# EAGLE design 611_jetbot_128 (EAGLE 9.6.2)
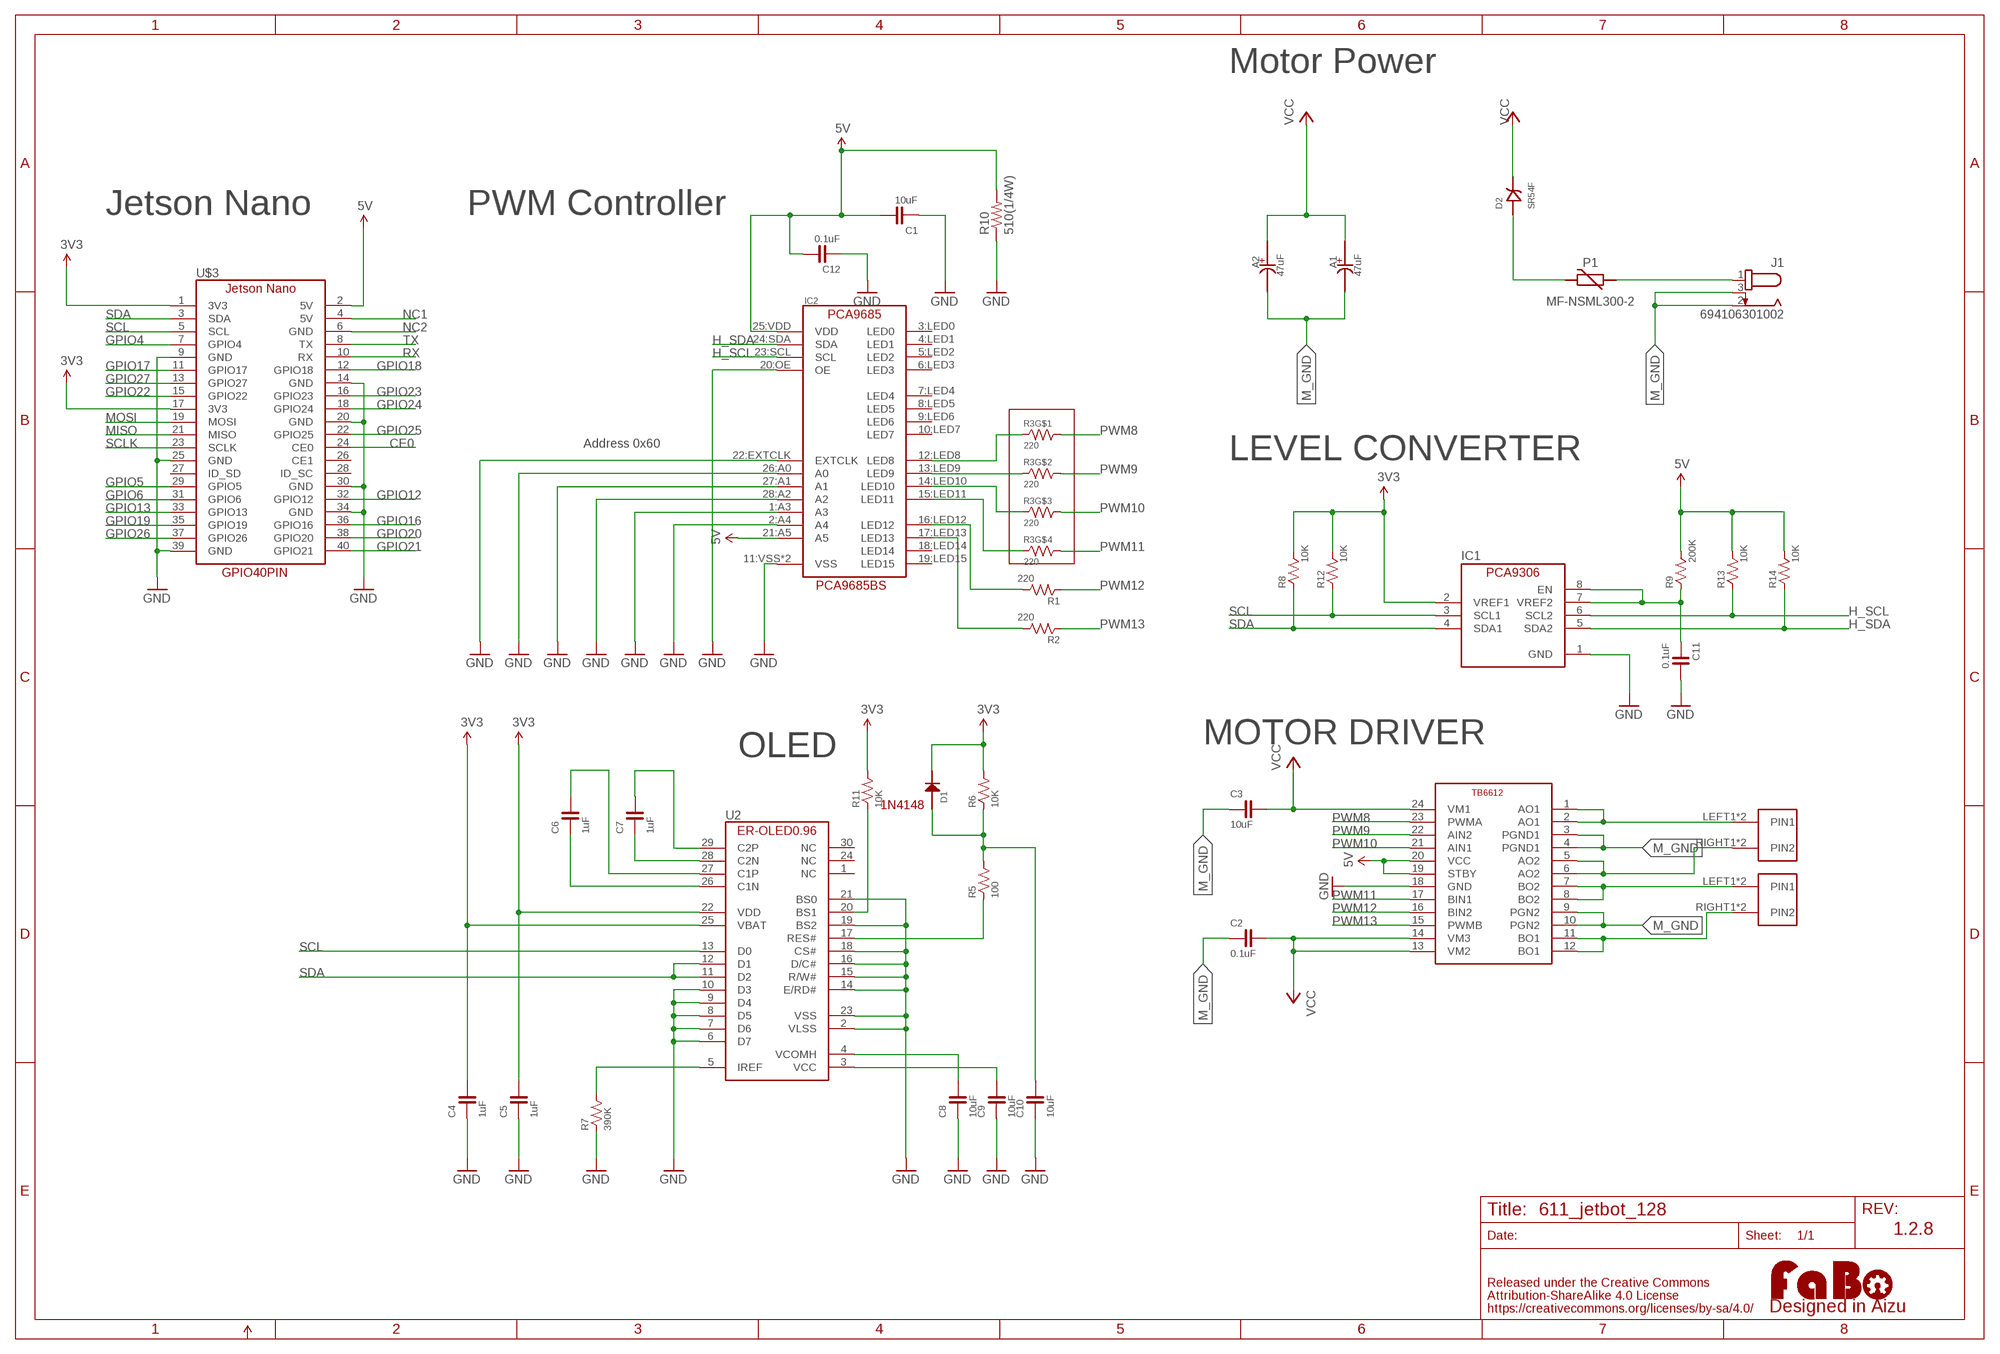
[diagram p0: schematic, sheet 1]

## Parts
A1  47uF  CAPACITOR-ALUMIN_D60  [D60]
A2  47uF  CAPACITOR-ALUMIN_D60  [D60]
C1  10uF  CAPACITOR-0603  [0603]
C2  0.1uF  CAPACITOR-0603  [0603]
C3  10uF  CAPACITOR-0603  [0603]
C4  1uF  CAPACITOR-0603-BOTTOM  [0603-BOTTOM]
C5  1uF  CAPACITOR-0603-BOTTOM  [0603-BOTTOM]
C6  1uF  CAPACITOR-0603-BOTTOM  [0603-BOTTOM]
C7  1uF  CAPACITOR-0603-BOTTOM  [0603-BOTTOM]
C8  10uF  CAPACITOR-0603-BOTTOM  [0603-BOTTOM]
C9  10uF  CAPACITOR-0603-BOTTOM  [0603-BOTTOM]
C10  10uF  CAPACITOR-0603-BOTTOM  [0603-BOTTOM]
C11  0.1uF  CAPACITOR-0603  [0603]
C12  0.1uF  CAPACITOR-0603  [0603]
D1  1N4148  [1N4148W]
D2  SR54F  [SMBF]
IC1  PCA9306_SSOP  [8PIN-SSOP]
IC2  PCA9685BSPCA9685BS  [HVQFN28]
J1  694106301002  [694106301002]
LOGO1  LOGO_FABO-M  [LOGO_FABO_M]
P1  MF-NSML300-2  POLYSWITCH1206  [1206]
R1  220  RESISTOR-0603  [0603]
R2  220  RESISTOR-0603  [0603]
R3  220  RESISTOR_ARRAY  [EXBV8V]
R5  100  RESISTOR-0603-BOTTOM  [0603-BOTTOM]
R6  10K  RESISTOR-0603-BOTTOM  [0603-BOTTOM]
R7  390K  RESISTOR-0603-BOTTOM  [0603-BOTTOM]
R8  10K  RESISTOR-0603  [0603]
R9  200K  RESISTOR-0603  [0603]
R10  510(1/4W)  R-US_R0805  [R0805]
R11  10K  RESISTOR-0603-BOTTOM  [0603-BOTTOM]
R12  10K  RESISTOR-0603  [0603]
R13  10K  RESISTOR-0603  [0603]
R14  10K  RESISTOR-0603  [0603]
U2  ER-OLED0.96-1ER-CON30HT-1_REV2  [ER-CON30HT-1_REV2]
U$3  JETSON_NANO  [JETSON_NANO]
U$5  TB6612  [TB6612]
U$6  ML-1400-S1  [ML-1400-S1]
U$8  ML-1400-S1  [ML-1400-S1]

## Nets
3V3: C4.2 C5.2 D1.CATHODE IC1.2(VREF1) R6.2 R8.2 R11.2 R12.2 U2.22(VDD) U2.25(VBAT) U$3.1(3V3) U$3.17(3V3)
5V: C1.2 C12.2 IC2.21:A5(A5) IC2.25:VDD(VDD) R9.2 R10.2 R13.2 R14.2 U$3.2(5V) U$5.19(STBY) U$5.20(VCC)
CE0: U$3.24(CE0)
GND: C1.1 C4.1 C5.1 C8.1 C9.1 C10.1 C11.2 C12.1 IC1.1(GND) IC2.1:A3(A3) IC2.2:A4(A4) IC2.11:VSS(VSS) IC2.20:OE(OE) IC2.22:EXTCLK(EXTCLK) IC2.26:A0(A0) IC2.27:A1(A1) IC2.28:A2(A2) IC2.29(VSS) R7.1 R10.1 U2.2(VLSS) U2.6(D7) U2.7(D6) U2.8(D5) U2.9(D4) U2.10(D3) U2.14(E/RD#) U2.15(R/W#) U2.16(D/C#) U2.18(CS#) U2.19(BS2) U2.21(BS0) U2.23(VSS) U$3.9(GND) U$3.14(GND) U$3.20(GND) U$3.25(GND) U$3.30(GND) U$3.34(GND) U$3.39(GND) U$5.18(GND)
GPIO4: U$3.7(GPIO4)
GPIO5: U$3.29(GPIO5)
GPIO6: U$3.31(GPIO6)
GPIO12: U$3.32(GPIO12)
GPIO13: U$3.33(GPIO13)
GPIO16: U$3.36(GPIO16)
GPIO17: U$3.11(GPIO17)
GPIO18: U$3.12(GPIO18)
GPIO19: U$3.35(GPIO19)
GPIO20: U$3.38(GPIO20)
GPIO21: U$3.40(GPIO21)
GPIO22: U$3.15(GPIO22)
GPIO23: U$3.16(GPIO23)
GPIO24: U$3.18(GPIO24)
GPIO25: U$3.22(GPIO25)
GPIO26: U$3.37(GPIO26)
GPIO27: U$3.13(GPIO27)
H_SCL: IC1.6(SCL2) IC2.23:SCL(SCL) R13.1
H_SDA: IC1.5(SDA2) IC2.24:SDA(SDA) R14.1
M_GND: A1.MINUS(-) A2.MINUS(-) C2.1 C3.1 J1.2 J1.3 U$5.3(PGND1) U$5.4(PGND1) U$5.9(PGN2) U$5.10(PGN2)
MISO: U$3.21(MISO)
MOSI: U$3.19(MOSI)
N$14: C6.2 U2.27(C1P)
N$16: C6.1 U2.26(C1N)
N$17: U$5.1(AO1) U$5.2(AO1) U$6.LEFT1(PIN1) U$6.LEFT2(PIN1)
N$18: U$5.5(AO2) U$5.6(AO2) U$6.RIGHT1(PIN2) U$6.RIGHT2(PIN2)
N$19: C7.1 U2.28(C2N)
N$20: U$5.7(BO2) U$5.8(BO2) U$8.LEFT1(PIN1) U$8.LEFT2(PIN1)
N$21: C7.2 U2.29(C2P)
N$22: U$5.11(BO1) U$5.12(BO1) U$8.RIGHT1(PIN2) U$8.RIGHT2(PIN2)
N$23: R7.2 U2.5(IREF)
N$24: C8.2 U2.4(VCOMH)
N$25: C9.2 U2.3(VCC)
N$26: R5.1 U2.17(RES#)
N$27: C10.2 D1.ANODE R5.2 R6.1
N$28: R11.1 U2.20(BS1)
N$29: C11.1 IC1.7(VREF2) IC1.8(EN) R9.1
NC1: U$3.4(5V)
NC2: U$3.6(GND)
P8: IC2.12:LED8(LED8) R3.1
P9: IC2.13:LED9(LED9) R3.2
P10: IC2.14:LED10(LED10) R3.3
P11: IC2.15:LED11(LED11) R3.4
P12: IC2.16:LED12(LED12) R1.2
P13: IC2.17:LED13(LED13) R2.2
PTCP1: J1.1 P1.1
PTCP2: D2.ANODE P1.2
PWM8: R3.8 U$5.23(PWMA)
PWM9: R3.7 U$5.22(AIN2)
PWM10: R3.6 U$5.21(AIN1)
PWM11: R3.5 U$5.17(BIN1)
PWM12: R1.1 U$5.16(BIN2)
PWM13: R2.1 U$5.15(PWMB)
RX: U$3.10(RX)
SCL: IC1.3(SCL1) R12.1 U2.13(D0) U$3.5(SCL)
SCLK: U$3.23(SCLK)
SDA: IC1.4(SDA1) R8.1 U2.11(D2) U2.12(D1) U$3.3(SDA)
TX: U$3.8(TX)
VCC: A1.PLUS(+) A2.PLUS(+) C2.2 C3.2 D2.CATHODE U$5.13(VM2) U$5.14(VM3) U$5.24(VM1)
Unconnected: IC2.3:LED0(LED0) IC2.4:LED1(LED1) IC2.5:LED2(LED2) IC2.6:LED3(LED3) IC2.7:LED4(LED4) IC2.8:LED5(LED5) IC2.9:LED6(LED6) IC2.10:LED7(LED7) IC2.18:LED14(LED14) IC2.19:LED15(LED15) U2.1(NC) U2.24(NC) U2.30(NC) U$3.26(CE1) U$3.27(ID_SD) U$3.28(ID_SC)

## Notes on the sheet
- Motor Power
- Jetson Nano | PWM Controller
- Address 0x60
- LEVEL CONVERTER
- GPIO40PIN
- PCA9685BS
- MOTOR DRIVER
- OLED
- 1N4148
- 1.2.8

## Library data of the parts
A1 A2 = FaBo-Capacitor:CAPACITOR-ALUMIN
C1-C12 = FaBo-Capacitor:CAPACITOR: CAPACITOR
D1 = FaBo-Diode:1N4148
D2 = FaBo-Diode:SR54F: SURFACE MOUNT SCHOTTKY BARRIER RECTIFIER 40V Volts 5 Amperes SMBF molded plastic Forwaord Voltage 0.55V DC Reverse Current 0.1mA
IC1 = FaBo-LevelTranslator:PCA9306
IC2 = FaBo-Motor:PCA9685BS
J1 = DC Power Jacks:694106301002: CONN PWR JACK 2.1X5.5MM SOLDER Manufacturer's datasheet <https://katalog.we-online.de/em/datasheet/6941xx301002.pdf>; CREATED_BY: PCBLayout.com; DIGIKEY_PART_NUMBER: 732-5930-ND; MANUFACTURER: Wurth Electronics Inc.; MPN: 694106301002
LOGO1 = component:LOGO_FABO
P1 = FaBo-Supply:POLYSWITCH
R1 R2 R5-R9 R11-R14 = FaBo-Resistors:RESISTOR: RESISTOR
R3 = component:RESISTOR_ARRAY
R10 = rcl:R-US_: RESISTOR, American symbol; SPICEPREFIX: R
U2 = FaBo-Display:ER-OLED0.96-1: ER-CON30HT-1 Rev2 wide distance 0.23mm
U$3 = FaBo-Boards:JETSON_NANO
U$5 = FaBo-Motor:TB6612
U$6 U$8 = FaBo-Terminal:ML-1400-S1

## Board
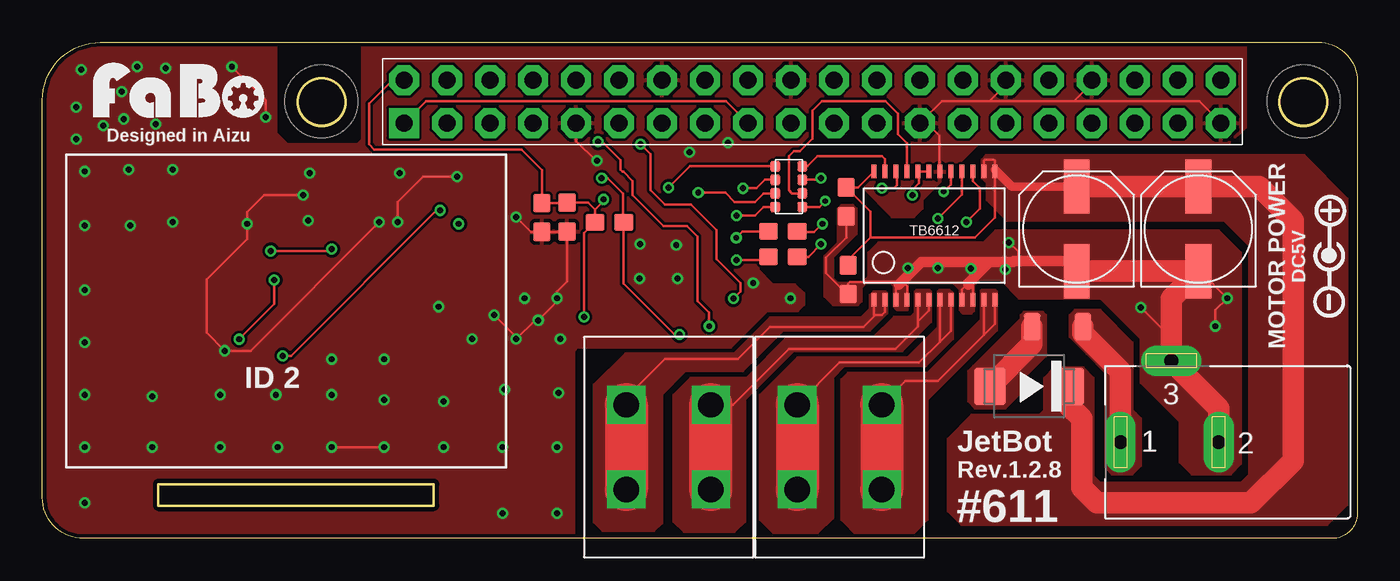
[diagram p1: board, top side]
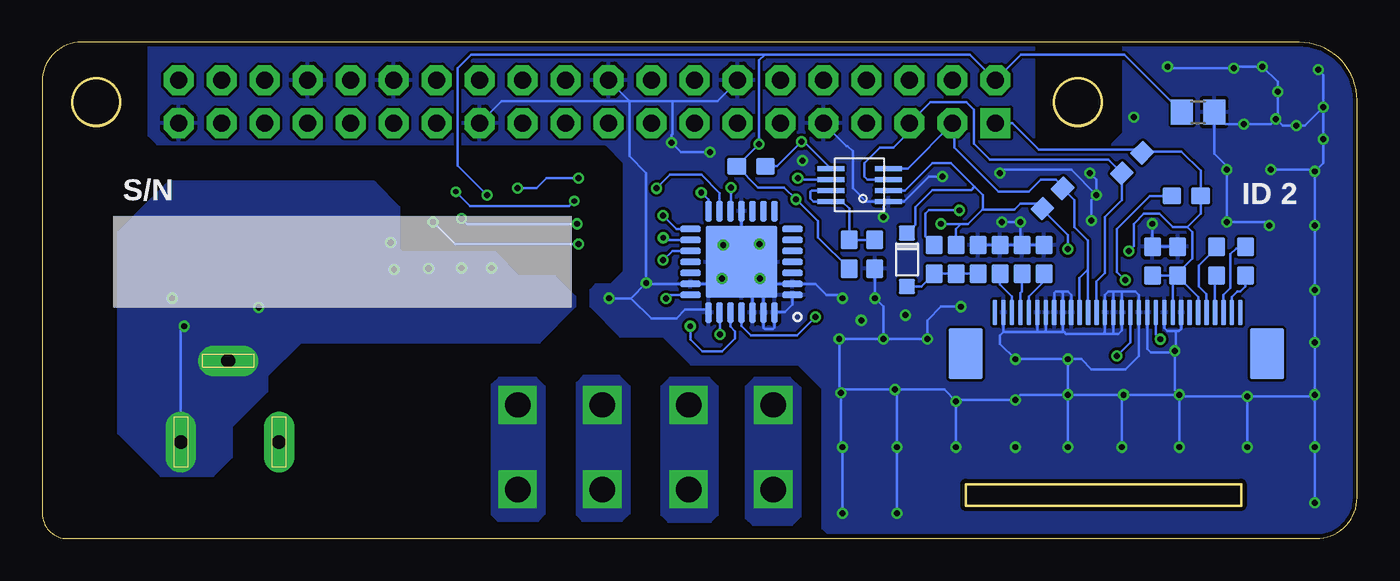
[diagram p2: board, bottom side, seen from below]

Size 77.68 x 29.33 mm. Coordinates in mm from the lower left corner, seen from the top.
Outline: 6.85,1.94 23.13,1.94 23.13,3.21 6.85,3.21 6.85,1.94
Outline: circle at 16.5,25.8 radius 1.4
Outline: circle at 74.5,25.8 radius 1.4
Copper layers (1*16): Top 0.035mm / dielectric 1.6mm / Bottom 0.035mm
Design rules "PCBway": minimum track width 6mil, minimum drill 12mil, track to track 6mil, track to pad 6mil, pad to pad 6mil, via to via 6mil, smd to smd 6mil, copper to edge 10mil, drill to drill 10mil, minimum pad ring 10mil, minimum via ring 6mil, stop-mask expansion 2mil, vias tented up to drill 100mil, thermal gap 8mil
tKeepout: area 29.2,-1.1 to 31.9,11.9
bRestrict: 11 lines

### Footprints (pad centres in the part's own frame; a part is rotated, then mirrored left to right if it is on the bottom)
D60 = smd 3.2 x 1.524: MINUS -2.5,0; PLUS 2.5,0
0603 = smd 1.1 x 1: 1 -0.85,0; 2 0.85,0
0603-BOTTOM = smd 1.1 x 1 bottom: 1 -0.85,0; 2 0.85,0
1N4148W = smd 0.9 x 0.95: ANODE 0,0; CATHODE 3.15,0
SMBF = smd 1.85 x 2.2: ANODE 2.325,0; CATHODE -2.325,0
8PIN-SSOP = smd 0.3 x 1.6: 1 -0.975,-1.7; 2 -0.325,-1.7; 3 0.325,-1.7; 4 0.975,-1.7; 5 0.975,1.7; 6 0.325,1.7; 7 -0.325,1.7; 8 -0.975,1.7
HVQFN28 = smd 1.2 x 0.38: 1:A3 -3,1.95; 2:A4 -3,1.3; 3:LED0 -3,0.65; 4:LED1 -3,0; 5:LED2 -3,-0.65; 6:LED3 -3,-1.3; 7:LED4 -3,-1.95; 15:LED11 3,-1.95; 16:LED12 3,-1.3; 17:LED13 3,-0.65; 18:LED14 3,0; 19:LED15 3,0.65; 20:OE 3,1.3; 21:A5 3,1.95 | smd 0.38 x 1.2: 8:LED5 -1.95,-3; 9:LED6 -1.3,-3; 10:LED7 -0.65,-3; 11:VSS 0,-3; 12:LED8 0.65,-3; 13:LED9 1.3,-3; 14:LED10 1.95,-3; 22:EXTCLK 1.95,3; 23:SCL 1.3,3; 24:SDA 0.65,3; 25:VDD 0,3; 26:A0 -0.65,3; 27:A1 -1.3,3; 28:A2 -1.95,3 | smd 4.25 x 4.25: 29 0,0
694106301002 = drill 0.8 pad 1.8 long: 1 13.6,0; 2 7.8,0; 3 10.6,-4.8
1206 = smd 1 x 1.6: 1 -1.5,0; 2 1.5,0
EXBV8V = smd 0.6 x 0.6: 1 -1.2,-0.8; 2 -0.4,-0.8; 3 0.4,-0.8; 4 1.2,-0.8; 5 1.2,0.8; 6 0.4,0.8; 7 -0.4,0.8; 8 -1.2,0.8
R0805 = smd 1.3 x 1.5: 1 -0.95,0; 2 0.95,0
ER-CON30HT-1_REV2 = smd 0.27 x 1.5 bottom: 1 7,-0.23; 2 6.5,-0.23; 3 6,-0.23; 4 5.5,-0.23; 5 5,-0.23; 6 4.5,-0.23; 7 4,-0.23; 8 3.5,-0.23; 9 3,-0.23; 10 2.5,-0.23; 11 2,-0.23; 12 1.5,-0.23; 13 1,-0.23; 14 0.5,-0.23; 15 0,-0.23; 16 -0.5,-0.23; 17 -1,-0.23; 18 -1.5,-0.23; 19 -2,-0.23; 20 -2.5,-0.23; 21 -3,-0.23; 22 -3.5,-0.23; 23 -4,-0.23; 24 -4.5,-0.23; 25 -5,-0.23; 26 -5.5,-0.23; 27 -6,-0.23; 28 -6.5,-0.23; 29 -7,-0.23; 30 -7.5,-0.23 | smd 2 x 3 bottom: 31 -9.07,-2.67; 32 8.74,-2.67
JETSON_NANO = drill 1 pad 1.778 square: 1 -24.13,10.16 | drill 1 pad 1.778 octagon: 2 -24.13,12.7; 3 -21.59,10.16; 4 -21.59,12.7; 5 -19.05,10.16; 6 -19.05,12.7; 7 -16.51,10.16; 8 -16.51,12.7; 9 -13.97,10.16; 10 -13.97,12.7; 11 -11.43,10.16; 12 -11.43,12.7; 13 -8.89,10.16; 14 -8.89,12.7; 15 -6.35,10.16; 16 -6.35,12.7; 17 -3.81,10.16; 18 -3.81,12.7; 19 -1.27,10.16; 20 -1.27,12.7; 21 1.27,10.16; 22 1.27,12.7; 23 3.81,10.16; 24 3.81,12.7; 25 6.35,10.16; 26 6.35,12.7; 27 8.89,10.16; 28 8.89,12.7; 29 11.43,10.16; 30 11.43,12.7; 31 13.97,10.16; 32 13.97,12.7; 33 16.51,10.16; 34 16.51,12.7; 35 19.05,10.16; 36 19.05,12.7; 37 21.59,10.16; 38 21.59,12.7; 39 24.13,10.16; 40 24.13,12.7
TB6612 = smd 0.3 x 0.8: 1 -3.575,-3.8; 2 -2.925,-3.8; 3 -2.275,-3.8; 4 -1.625,-3.8; 5 -0.975,-3.8; 6 -0.325,-3.8; 7 0.325,-3.8; 8 0.975,-3.8; 9 1.625,-3.8; 10 2.275,-3.8; 11 2.925,-3.8; 12 3.575,-3.8; 13 3.575,3.8; 14 2.925,3.8; 15 2.275,3.8; 16 1.625,3.8; 17 0.975,3.8; 18 0.325,3.8; 19 -0.325,3.8; 20 -0.975,3.8; 21 -1.625,3.8; 22 -2.275,3.8; 23 -2.925,3.8; 24 -3.575,3.8
ML-1400-S1 = drill 1.5 square: LEFT1 -2.5,2.5; LEFT2 -2.5,-2.5; RIGHT1 2.5,2.5; RIGHT2 2.5,-2.5

### Placement (x,y rotation side)
A1  68.3,18.3 90 top
A2  61.1,18.3 90 top
C1  29.52,18.98 90 top
C2  47.6,15.3 90 top
C3  47.5,19.9 90 top
C4  10.6,16.4 270 top
C5  12.1,16.4 270 top
C6  8.3,16.4 270 top
C7  6.6,16.4 270 top
C8  19.8,16.5 270 top
C9  21.1,16.5 270 top
C10  22.4,16.5 270 top
C11  28.5,16.8 270 bottom
C12  31,19 90 top
D1  26.6,14.9 90 bottom
D2  58.3,9 180 top
IC1  29.4,20.9 90 bottom
IC2  36.38,16.35 180 bottom
J1  77.3,5.7 180 top
LOGO1  8.05,24.5 0 top
P1  59.98,12.52 180 top
R1  43.75,18.15 180 top
R2  43.75,16.65 180 top
R3  44.1,20.8 270 top
R5  25,16.5 270 top
R6  23.7,16.5 90 top
R7  18.5,16.5 270 top
R8  18,20.1 225 bottom
R9  30,16.8 270 bottom
R10  9.4,25.2 180 bottom
R11  10.1,20.25 180 top
R12  13.3,22.2 45 bottom
R13  33.5,18.7 180 top
R14  35.8,22 180 bottom
U2  14.4,13.6 0 top
U$3  45.5,14.4 0 top
U$5  52.7,17.9 0 top
U$6  37,5.4 0 top
U$8  47.1,5.4 0 top

### Tracks (layer width: path | path; a pad name or v marks a point on that pad's centre or on a via)
3V3  (via drill 0.35)
  Top 0.152: v13.5,17 17,17 v17.1,17.1 | U$3.17 40.4,25.85 22.66,25.85 U$3.1
  Bottom 0.152: R6.2 23.7,18.3 23.4,18.6 | 22.15,19.45 23,18.6 23.4,18.6 | 22.15,19.45 22.1,19.5 22.1,20.3 22.6,20.8 | v17.1,17.1 17.1,17.95 18.6,19.45 R8.2 18.9,19.8 19.9,19.8 20.25,19.45 22.15,19.45 | v24.6,18.6 23.4,18.6 | C4.2 10.6,15.69 | 10.6,15.69 9.75,16.55 9.75,18.1 10.05,18.4 | v13.5,17 13.2,17.3 13.2,18.6 12.6,19.2 11.7,19.2 10.9,18.4 10.05,18.4 | 10.74,15.55 10.6,15.69 | U$3.1 20.37,24.56 18.81,23 12.9,23 12.77,22.88 | 22.6,20.8 24,22.2 25.1,22.2 26.73,20.58 IC1.2 | 22.6,20.8 22.8,20.6 25.1,20.6 26.1,19.6 26.1,18.55 D1.CATHODE | R12.2 12.77,22.88 | 12.77,22.88 10.38,22.88 9.25,21.75 R11.2 9.25,19.2 10.05,18.4 | 10.6,15.42 C4.2 | C5.2 10.74,15.55 | U2.25 9.4,14.28 10.6,15.47 C4.2 | U2.22 10.9,15.39 10.74,15.55
5V  (via drill 0.35)
  Top 0.152: U$3.2 20.7,27.1 19.3,25.7 19.3,23.3 19.6,23 28.3,23 29.52,21.79 C1.2 30.98,19.83 C12.2 32.25,19.85 32.65,19.45 | U$5.19 U$5.20 51.8,21.62 51.8,21 51.4,20.6 v51.4,20.3 | 32.65,19.45 R13.2 32,18.05 v32,13.1 | v33.15,20.05 33.15,19.95 32.65,19.45 | v35.35,23.3 35.92,22.73 35.92,20.6 36.8,19.73 38.33,19.73 39.83,18.23 39.83,16.52 41.25,15.1 41.25,14.6 v40.83,14.18
  Bottom 0.152: 35,28.61 52.34,28.61 53.15,27.8 53.15,22.05 v51.4,20.3 | 35,28.61 22.88,28.61 U$3.2 19.87,28.6 13.75,28.6 R10.2 | 35,28.61 35.35,28.26 v35.35,23.3 R14.2 35.4,20.75 33.85,20.75 v33.15,20.05 31.85,18.75 31.85,17.8 R9.2 | v32,13.1 33.1,12 35.8,12 36.38,12.58 IC2.25:VDD | IC2.21:A5 40.6,14.4 v40.83,14.18
GND  (via drill 0.35)
  Top 0.152: 55.95,25.85 53.14,25.85 51.95,24.66 | 51.95,24.66 U$3.25 | v19.9,18.7 12.3,11.1 v10.77,11.1 9.7,12.17 9.7,15.3 12.1,17.7 v12.1,18.6 12.1,19.3 13.1,20.3 v15.4,20.3 | U$3.30 56.93,26.83 55.95,25.85 | U$3.39 68.34,25.85 60.95,25.85 | 55.95,25.85 60.95,25.85 | U$3.34 62.01,26.91 60.95,25.85 | v20.2,5.4 v17.1,5.4 | v28,19 28.88,18.12 C1.1 30.98,18.12 C12.1 31,15.2 30.4,14.6 v30.4,14.2 30.4,14 v29.3,12.9 29.1,12.9 v28,11.8 28,11.9 v26.7,13.2 | U$5.18 53,21.73 53,23.8 52.15,24.66 51.95,24.66 | v24.5,21.4 22.5,21.4 21,19.9 v21,18.7 | v13.2,24.9 13.2,25.9 v11.2,27.9 | v32.77,22.33 32.7,22.33 31.53,23.49 U$3.9
  Bottom 0.152: 42.98,25.85 40.45,25.85 | 40.45,25.85 37.8,25.85 36.61,27.04 U$3.14 | 43,25.85 42.98,25.85 | 42.98,25.85 U$3.20 | U$3.25 50.56,25.85 43,25.85 | 20.9,12.2 18.8,12.2 | 18.8,12.2 18.5,12.2 | 18.5,12.2 17.3,12.2 | 17.3,12.2 17.4,12.3 U2.9 17.4,14.5 17.5,14.6 | 10.7,12.28 11.22,12.28 11.4,12.45 U2.21 | 10.7,12.28 10.53,12.28 10.4,12.4 U2.23 | C4.1 C5.1 v12.1,18.6 | R7.1 C8.1 | C8.1 C9.1 C10.1 | C8.1 19.9,17.45 v19.9,18.7 v21,18.7 | 10.7,12.28 10.7,11.17 v10.77,11.1 10.77,11 | 20.9,12.2 21.1,12 21.1,11.5 v20.2,10.6 v17.1,10.6 | v15.4,20.3 16.9,21.8 20.9,21.8 v21.1,21.6 | v2.5,21.7 2.6,21.8 v5.1,21.8 | v2.5,21.7 v2.5,18.5 v2.5,14.7 v2.5,11.6 v2.5,8.5 | v2.5,8.5 2.6,8.4 v6.5,8.4 | 10.77,11 10.77,8.77 v10.5,8.5 | v10.5,8.5 10.4,8.4 v6.5,8.4 | v10.5,8.5 v13.8,8.5 | v13.8,8.5 v17.1,8.5 | v17.1,10.6 v17.1,8.5 | v2.5,8.5 v2.5,5.4 v2.5,2.1 | v6.5,8.4 v6.5,5.4 | v10.5,8.5 v10.5,5.4 | v13.8,8.5 13.9,8.4 v13.9,5.4 | v17.1,8.5 v17.1,5.4 | U2.19 12.4,11.2 12.2,11 10.77,11 | v17.1,10.6 16.3,10.6 15.7,10 13.7,10 12.9,10.8 U2.18 12.9,14.4 13.1,14.6 13.9,14.6 | 17.3,12.2 17.2,12.1 15,12.1 | 14.4,12.1 14.1,12.1 13.9,12.3 U2.16 13.9,14.6 | 14.4,12.1 15,12.1 | 14.4,12.1 U2.15 14.4,14.6 | 15,12.1 14.9,12.2 U2.14 14.9,14.4 14.7,14.6 14.4,14.6 | 17.5,14.6 17.1,14.6 16.9,14.4 U2.10 | 17.5,14.6 17.8,14.6 17.9,14.5 U2.8 | U2.2 20.9,12.2 | U2.6 18.9,12.3 18.8,12.2 | U2.7 18.4,12.3 18.5,12.2 | 13.9,14.6 14.4,14.6 | 27.71,19.91 IC1.1 26.77,19.92 25.3,21.4 v24.5,21.4 | 27.71,19.91 28,19.62 v28,19 | U$3.9 30.17,23.2 30.1,23.2 29.8,22.9 29.8,20.7 29.01,19.91 27.71,19.91 | 42,15.2 42,21.6 43,22.6 43,25.85 | 42,15.2 v42,15.1 42.9,14.2 | C11.2 v28.5,14.2 28,13.7 28,11.9
  Bottom 0.152: v2,25.5 2,27.4 v2.3,27.7 | v2,25.5 v2,23.6 2,22.2 v2.5,21.7 | v4.8,24.8 5.1,24.5 v6.7,24.5 7.75,24.5 R10.1 8.45,22.75 7.5,21.8 v7.7,21.8 7.8,21.8 7.7,21.7 v7.7,18.7 5.4,18.7 v5.2,18.5 | v4.8,24.8 4.7,24.9 v4.7,26.4 4.7,27 v5.6,27.9 7.2,27.9 v7.3,27.8 11.1,27.8 v11.2,27.9 | v2,25.5 3.1,24.4 v3.6,24.4 4.4,24.4 v4.8,24.8 | v17.1,8.5 19.9,8.5 v20.2,8.2 23.6,8.2 v23.7,8.1 | v23.7,8.1 24.4,8.8 v27.3,8.8 27.4,8.8 | 27.4,8.8 30.3,8.8 30.35,8.75 | 30.35,8.75 v30.5,8.6 30.5,5.5 v30.4,5.4 v30.4,1.5 | 27.4,8.8 27.2,8.6 v27.2,5.4 v27.2,1.5 | v23.7,5.4 v23.7,8.1 | v23.4,13.7 24.6,13.7 25.4,12.9 v25.4,11.8 v28,11.8 28,11.9 | 28,11.9 28.1,11.8 v30.6,11.8 30.6,9 30.35,8.75 | v44.2,14.2 42.9,14.2 | 40.45,25.85 40.45,23.9 40.5,23.85 v40.5,23.4 39.95,22.85 v38.23,22.85 | 42,15.2 41.85,15.05 IC2.20:OE 37.85,15.05 v37.52,15.38 36.55,16.35 IC2.29 | v30.4,14.2 30.6,14.4 31.35,14.4 32,15.05 IC2.2:A4 35.08,15.05 | v15.4,20.3 15.4,21.2 v15.8,21.6 | v15.7,18.8 15.7,20 v15.4,20.3 | IC2.26:A0 35.73,15.7 | IC2.1:A3 33.38,13.83 33.8,13.4 34.38,13.4 IC2.28:A2 34.42,12.47 34.52,12.38 35,12.38 35.08,12.45 IC2.27:A1 35.08,15.05 | 35.08,15.05 35.73,15.7 | IC2.29 36.35,16.35 v35.3,17.4 | IC2.29 37.38,17.35 v37.45,17.35 | IC2.29 35.73,15.7 | IC2.29 IC2.11:VSS | IC2.29 35.4,15.38 v35.27,15.38 | IC2.22:EXTCLK 38.5,13.53 39.7,13.53 40.23,13 41.7,13 42.9,14.2
  pour Bottom: -1.3,27.4 2.3,31 12,31 13.8,29.2 13.8,24 14.6,23.2 18.9,23.2 19.1,23.4 19.1,29.2 21.1,31.2 69.3,31.2 71.4,29.1 71.4,23.8 70.9,23.3 44.4,23.3 43.3,22.2 43.3,15.8 44.1,15 45,15 45.3,14.7 45.3,13.7 43.55,11.95 41,11.95 39.35,10.3 33.05,10.3 31.6,8.85 31.6,0.6 30,-1 2.2,-1 -1.3,2.5
  pour Top: -2.4,27.2 1.7,31.3 12.4,31.3 13.8,29.9 13.8,24 14.5,23.3 18.6,23.3 18.9,23.6 18.9,29.5 21.2,31.8 69.5,31.8 71.1,30.2 71.1,24.3 70.1,23.3 55.3,23.3 52,20 52,19.5 51.5,19 50.2,19 48.5,20.7 48.5,21.6 47.45,22.65 43.35,22.65 42.3,21.6 42.3,15.9 43.17,15.03 44.48,15.03 45,14.5 45,13.8 44.65,13.45 42.85,13.45 40.7,11.3 31.6,11.3 31.4,11.1 31.4,-0.1 30.1,-1.4 -0.1,-1.4 -2.4,0.9
H_SCL  (via drill 0.35)
  Top 0.152: R13.1 34.3,18.75 | 34.3,18.75 34.3,20.4 33.4,21.3 v33.05,21.3 | 34.3,18.75 34.33,18.75 34.33,15.08 37.35,12.05 v37.65,12.05
  Bottom 0.152: v33.05,21.3 32.98,21.23 IC1.6 | v37.65,12.05 37.65,13.33 IC2.23:SCL
H_SDA  (via drill 0.35)
  Top 0.152: v39.4,12.55 39.4,13.35 38.7,14.05 38.7,17.85 38.08,18.48 36.7,18.48 34.88,20.3 34.88,21.12 34.33,21.67 34.27,21.67 34.15,21.8 34.15,22.38 33.08,23.45 v32.83,23.45
  Bottom 0.152: 31.12,21.9 IC1.5 32.67,23.45 v32.83,23.45 34.27,22 R14.1 | v39.4,12.55 39.4,11.78 38.67,11.05 37.52,11.05 36.75,11.83 36.75,12.25 37.02,12.53 IC2.24:SDA
M_GND  (via drill 0.35)
  Top 0.152: 50.6,15 51,15 51.1,14.9 51.1,14.12 U$5.4 | 50.6,15 50.45,15.15 47.7,15.15 47.6,15.05 C2.1 47.55,14.45 46.3,15.7 46.3,16.6 47.5,17.8 C3.1 | U$5.10 54.98,14.93 54.9,15 54.7,15 54.6,15 54.33,14.72 U$5.9 | v51.15,16 51.08,15.92 51.08,15.47 | v57.1,17.5 57.65,16.95 57.65,16.4 | v64.9,13.65 66.7,11.85 66.7,11.45 | v69.3,12.55 69.3,13.5 v70,14.2 68.4,15.8 A1.MINUS | 57.4,16.4 v56.9,15.9 | v52.9,16 52.9,16.3 52.95,16.35 | v54.85,15.95 54.85,16.35 | U$5.3 50.42,14.83 50.6,15
  Top 0.61: A2.MINUS 60.5,16.4 57.65,16.4 57.4,16.4 57.35,16.35 55.95,16.35 | 55.95,16.35 54.7,15.1 54.7,15 | 55.95,16.35 54.85,16.35 52.95,16.35 51.95,16.35 51.08,15.47 50.6,15
  Top 1.27: J1.2 69.5,7.7 J1.3 66.7,11.45 66.7,14.2 A1.MINUS A2.MINUS
  Bottom 0.152: J1.2 69.5,12.35 v69.3,12.55
  pour Top (no thermals): 62.5,14.2 64.9,11.8 64.9,9.2 67.2,6.9 67.2,4.5 67.9,3.8 70.2,3.8 70.8,4.4 70.8,16.9 69.5,18.2 56.3,18.2 55.6,17.5 49.4,17.5 48.8,16.9 48.8,15.5 48.4,15.1 47,15.1 46.7,15.4 46.7,16.6 48.1,18 48.1,19.5 47.9,19.7 47.2,19.7 47,19.5 47,17.5 46.2,16.7 46.2,14.3 46.7,13.8 48.2,13.8 48.4,14 48.4,14.8 48.7,15.1 50.1,15.1 50.3,14.9 50.3,13.7 50.5,13.5 51.1,13.5 51.1,15.1 53.8,15.1 54.2,14.7 54.2,13.5 54.4,13.3 54.9,13.3 55.05,13.45 55.05,14.95 55.4,15.3 56.6,15.3 57.7,14.2
  pour Bottom (no thermals): 66.5,4.8 67.6,3.7 70.7,3.7 73.2,6.2 73.2,11.1 73.2,18.1 70.2,21.1 58.1,21.1 58,21 56.6,19.6 56.6,17.1 56.4,16.9 50.9,16.9 49.5,15.5 47.4,15.5 46.2,14.3 46.2,13.7 48.3,11.6 62.4,11.6 64.4,9.6 64.4,8.7 66.5,6.6
N$14
  Bottom 0.152: C6.2 8.4,15.45 U2.27
N$16
  Bottom 0.152: C6.1 8.3,17.2 9.35,16.15 9.35,14.9 8.9,14.45 U2.26
N$17
  Top 0.152: U$5.1 49.12,13.2 49.23,13.2 | 49.23,13.2 48.52,12.5 43,12.5 41.1,10.6 36.8,10.6 33.6,7.4 34,7.4 U$6.LEFT1 | U$5.2 49.77,13.38 49.6,13.2 49.23,13.2
  Top 2.54: U$6.LEFT1 U$6.LEFT2
  pour Bottom (no thermals): 32.9,1.3 32.9,8.9 33.5,9.5 35.6,9.5 36.1,9 36.1,1.2 35.7,0.8 33.4,0.8
  pour Top (no thermals): 32.6,0.95 32.6,9.1 34.45,10.95 40.88,10.95 43,13.08 48.38,13.08 48.9,13.6 48.9,14.4 49.1,14.6 49.8,14.6 49.9,14.5 49.9,13.3 48.9,12.3 43.8,12.3 41.4,9.9 38,9.9 36.6,8.5 36.6,0.9 36.15,0.45 33.1,0.45
N$18
  Top 0.152: U$6.RIGHT1 40.8,7.9 44.1,11.2 50.4,11.2 51.73,12.53 51.73,12.83 | 51.73,12.83 U$5.5 | U$5.6 52.38,13.47 51.73,12.83
  Top 2.54: U$6.RIGHT2 U$6.RIGHT1
  pour Bottom (no thermals): 37.8,9 38.3,9.5 40.6,9.5 41.1,9 41.1,1.4 40.7,1 38.2,1 37.8,1.4
  pour Top (no thermals): 37.3,1 37.9,0.4 40.9,0.4 41.5,1 41.5,8.2 44.4,11.1 50.8,11.1 52.5,12.8 52.5,14.6 52.4,14.7 51.65,14.7 51.55,14.6 51.55,13.35 51.3,13.1 50.3,13.1 49.1,11.9 44,11.9 41.6,9.5 38.3,9.5 37.3,8.5
N$19
  Bottom 0.152: C7.1 6.6,17.15 7.15,17.15 7.5,16.8 7.5,14.8 7.9,14.4 U2.28
N$20
  Top 0.152: U$8.LEFT1 47.1,10.4 51.8,10.4 53.02,11.62 | 53.02,11.62 U$5.7 | U$5.8 53.67,12.28 53.02,11.62
  Top 2.54: U$8.LEFT1 U$8.LEFT2
  pour Bottom (no thermals): 43,1.5 43,9 43.6,9.6 45.7,9.6 46.1,9.2 46.1,1.4 45.75,1.05 43.45,1.05
  pour Top (no thermals): 46.7,9.5 46.7,1.2 45.8,0.3 43.2,0.3 42.4,1.1 42.4,8.5 44.6,10.7 51.1,10.7 52.9,12.5 52.9,14.6 53,14.7 53.6,14.7 53.8,14.5 53.8,11.8 52.2,10.2 47.4,10.2
N$21
  Bottom 0.152: C7.2 6.6,14.89 6.89,14.6 7.07,14.6 7.4,14.27 U2.29
N$22
  Top 0.152: U$8.RIGHT1 51,9.3 52.9,9.3 55.62,12.03 | 55.62,12.03 U$5.11 | U$5.12 56.27,12.68 55.62,12.03
  Top 2.54: U$8.RIGHT1 U$8.RIGHT2
  pour Bottom (no thermals): 48,1.45 48,9 48.5,9.5 50.7,9.5 51.1,9.1 51.1,1.4 50.75,1.05 48.4,1.05
  pour Top (no thermals): 47.2,9.4 47.2,1.1 48.2,0.1 51.3,0.1 52.3,1.1 52.3,8.2 56.4,12.3 56.4,14.6 56.3,14.7 55.5,14.7 55.45,14.65 55.45,12.95 52.3,9.8 47.6,9.8
N$23
  Bottom 0.152: R7.2 18.5,15.2 19.4,14.3 U2.5
N$24
  Bottom 0.152: C8.2 19.8,14.6 19.9,14.5 U2.4
N$25
  Bottom 0.152: C9.2 21.1,15 20.4,14.3 U2.3
N$26  (via drill 0.35)
  Top 0.152: v14.2,10.8 14.7,10.8 23.3,19.4 v23.5,19.4
  Bottom 0.152: R5.1 25.5,17.85 25.5,19.2 25.3,19.4 v23.5,19.4 | v14.2,10.8 13.4,11.6 U2.17
N$27
  Bottom 0.152: D1.ANODE 25.75,14.9 R5.2 R6.1 C10.2
N$28  (via drill 0.35)
  Top 0.152: v11.63,11.78 13.71,13.86 v13.71,15.28
  Bottom 0.152: R11.1 12.24,20.25 14.19,18.3 14.19,15.76 v13.71,15.28 | v11.63,11.78 11.9,12.05 U2.20
N$29
  Bottom 0.152: IC1.7 32.23,20.58 32.3,20.5 32.3,20.1 32.12,19.92 IC1.8 30.43,19.92 30,19.5 R9.1 C11.1
P8  (via drill 0.35)
  Top 0.152: v37,20.75 38.25,22 R3.1
  Bottom 0.152: v37,20.75 37,19.38 IC2.12:LED8
P9  (via drill 0.35)
  Top 0.152: R3.2 42.7,21.2 42.2,20.7 v41.4,20.7
  Bottom 0.152: v41.4,20.7 40.6,21.5 38.75,21.5 37.67,20.42 IC2.13:LED9
P10  (via drill 0.35)
  Top 0.152: R3.3 42.6,20.4 42.1,19.9 40.9,19.9 40.35,20.45 v38.75,20.45
  Bottom 0.152: IC2.14:LED10 38.33,20.02 v38.75,20.45
P11  (via drill 0.35)
  Top 0.152: v41,19.1 42.1,19.1 42.6,19.6 R3.4
  Bottom 0.152: v41,19.1 40.2,18.3 IC2.15:LED11
P12  (via drill 0.35)
  Top 0.152: R1.2 41.37,18.15 v40.99,17.77
  Bottom 0.152: v40.99,17.77 40.87,17.65 IC2.16:LED12
P13  (via drill 0.35)
  Top 0.152: v41,16.45 42.7,16.45 R2.2
  Bottom 0.152: v41,16.45 40.45,17 IC2.17:LED13
PTCP1
  Top 1.27: J1.1 63.7,9.89 61.48,12.12 P1.1
  pour Top (no thermals): 62.8,4.7 62.8,9.8 61.7,10.9 60.7,11.9 60.7,13.2 61,13.5 61.8,13.5 62.5,13.5 64.4,11.6 64.4,7.6 64.6,7.4 64.9,7.1 64.9,4.3 64.4,3.8 63.2,3.8 62.8,4.2
PTCP2
  Top 1.27: D2.ANODE 58.48,11.5 P1.2
  pour Top (no thermals): 56.7,7.7 55.1,7.7 54.7,8.1 54.7,9.9 55,10.2 57.8,13 57.8,13.2 58,13.4 58.4,13.4 59.1,13.4 59.3,13.2 59.3,10.8 57.7,9.2 57.7,8.5 56.9,7.7
PWM8
  Top 0.152: R3.8 45.2,22 45.8,22.6 49.6,22.6 49.77,22.42 U$5.23
PWM9  (via drill 0.35)
  Top 0.152: v49.6,20.71 50.31,20.71 50.5,20.9 50.5,21.62 U$5.22 | v46,21.3 45.9,21.2 R3.7
  Bottom 0.152: v46,21.3 47.9,21.3 48.49,20.71 v49.6,20.71
PWM10
  Top 0.152: U$5.21 51.08,23.38 50.55,23.9 50.55,25.1 49.8,25.85 46.05,25.85 45.5,25.3 45.5,23.65 44.75,22.9 44.4,22.9 44.1,22.6 44.1,20.6 44.3,20.4 R3.6
PWM11  (via drill 0.3)
  Top 0.152: v53.25,20.5 53.67,20.92 U$5.17 | R3.5 45.9,19.6 v46.25,19.95
  Bottom 0.152: v46.25,19.95 46.55,19.65 52.4,19.65 v53.25,20.5
PWM12  (via drill 0.35)
  Top 0.152: v46.1,18.6 45.6,18.1 44.65,18.1 R1.1 | v52.9,18.9 54.33,20.33 U$5.16
  Bottom 0.152: v46.1,18.6 52.6,18.6 v52.9,18.9
PWM13  (via drill 0.35)
  Top 0.152: v54.6,18.7 55.4,19.5 55.4,20.7 54.98,21.12 U$5.15 | R2.1 45.25,16.65 v46,17.4
  Bottom 0.152: v46,17.4 53.3,17.4 v54.6,18.7
SCL
  Bottom 0.152: U2.13 15.4,15.2 14.9,15.7 14.9,19 13.9,20 R12.1 14.7,22.4 21.7,22.4 22.65,23.35 22.65,25.35 23.1,25.8 25.21,25.8 U$3.5 26.45,24.05 27.4,23.1 28.2,23.1 29.1,22.2 29.1,21.4 28.93,21.23 IC1.3
SDA
  Bottom 0.152: 15.9,15.9 16.4,15.4 U2.11 | U2.12 15.9,15.9 | IC1.4 26.55,21.88 23.91,24.51 U$3.3 23.8,24.45 23.8,23.1 21.2,20.5 19.4,20.5 18.7,21.2 17.8,21.2 17.3,20.7 R8.1 16.7,20 16.7,18.4 15.9,17.6 15.9,15.9
VCC
  Top 0.152: U$5.14 55.62,22.33 55.7,22.4 56.2,22.4 56.27,22.33 56.27,21.8 U$5.13 56.27,18.98 55.1,17.8 48.95,17.8 48.92,17.77 | U$5.24 48.17,20.75 C3.2 48.92,19.33 48.92,17.77 | 48.92,17.77 47.6,16.45 C2.2
  Top 0.508: A2.PLUS 57.27,20.8 56.27,21.8
  Top 1.27: A2.PLUS A1.PLUS 71.9,20.8 73.9,18.8 73.9,4.6 71.4,2.1 62.3,2.1 61.4,3 61.4,7.1 60.62,7.88 D2.CATHODE
  pour Top (no thermals): 59.2,9.5 59.8,10.1 61.5,10.1 62.1,9.5 62.1,3.7 62.5,3.3 70.8,3.3 71.3,3.8 71.3,17.3 69.8,18.8 57,18.8 55.8,20 55.8,21 55.5,21.3 55.5,22.4 55.75,22.65 74.55,22.65 77.1,20.1 77.1,2 75.9,0.8 54.3,0.8 53.5,1.6 53.5,5.9 54.9,7.3 58.9,7.3 59.2,7.6

### Text on the board
tPlace: Designed in Aizu | MOTOR POWER | DC5V | ID 2 | JetBot | Rev.1.2.8 | #611
bPlace: S/N | ID 2
Document: PCA9685BS | SR54F | 694106301002 | #611 JetBot Controller Board(Rev 1.2.8) / fix ID02 2020/06/01